# Altium schematic sheet Sheet_1_2021-03-30.schdoc
size 203 x 97 mm
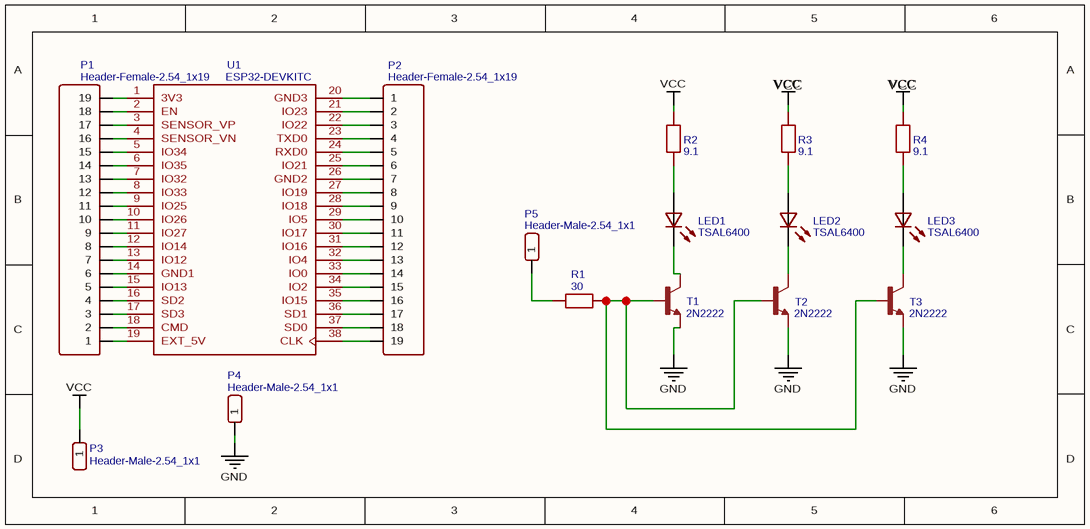
[diagram p0: Sheet_1_2021-03-30.schdoc]

## Parts
LED1  TSAL6400  [LED-5.8MM-2]
LED2  TSAL6400  [LED-5.8MM-2]
LED3  TSAL6400  [LED-5.8MM-2]
P1  Header-Female-2.54_1x19  [HDR-19X1/2.54]
P2  Header-Female-2.54_1x19  [HDR-19X1/2.54]
P3  Header-Male-2.54_1x1  [HDR-1X1/2.54]
P4  Header-Male-2.54_1x1  [HDR-1X1/2.54]
P5  Header-Male-2.54_1x1  [HDR-1X1/2.54]
R1  30  [AXIAL-0.3]
R2  9.1  [AXIAL-0.3]
R3  9.1  [AXIAL-0.3]
R4  9.1  [AXIAL-0.3]
T1  2N2222  [TO92-EBC-OVAL]
T2  2N2222  [TO92-EBC-OVAL]
T3  2N2222  [TO92-EBC-OVAL]
U1  ESP32-DEVKITC  [MODULE_ESP32-DEVKITC-32D]

## Nets
GND: P4.1 T1.E T2.E T3.E
VCC: P3.1 R2.2 R3.2 R4.2
NetLED1_1: LED1.1(A) R2.1
NetLED1_2: LED1.2(C) T1.C
NetLED2_1: LED2.1(A) R3.1
NetLED2_2: LED2.2(C) T2.C
NetLED3_1: LED3.1(A) R4.1
NetLED3_2: LED3.2(C) T3.C
NetP1_1: P1.1 U1.19(EXT_5V)
NetP1_2: P1.2 U1.18(CMD)
NetP1_3: P1.3 U1.17(SD3)
NetP1_4: P1.4 U1.16(SD2)
NetP1_5: P1.5 U1.15(IO13)
NetP1_6: P1.6 U1.14(GND1)
NetP1_7: P1.7 U1.13(IO12)
NetP1_8: P1.8 U1.12(IO14)
NetP1_9: P1.9 U1.11(IO27)
NetP1_10: P1.10 U1.10(IO26)
NetP1_11: P1.11 U1.9(IO25)
NetP1_12: P1.12 U1.8(IO33)
NetP1_13: P1.13 U1.7(IO32)
NetP1_14: P1.14 U1.6(IO35)
NetP1_15: P1.15 U1.5(IO34)
NetP1_16: P1.16 U1.4(SENSOR_VN)
NetP1_17: P1.17 U1.3(SENSOR_VP)
NetP1_18: P1.18 U1.2(EN)
NetP1_19: P1.19 U1.1(3V3)
NetP2_1: P2.1 U1.20(GND3)
NetP2_2: P2.2 U1.21(IO23)
NetP2_3: P2.3 U1.22(IO22)
NetP2_4: P2.4 U1.23(TXD0)
NetP2_5: P2.5 U1.24(RXD0)
NetP2_6: P2.6 U1.25(IO21)
NetP2_7: P2.7 U1.26(GND2)
NetP2_8: P2.8 U1.27(IO19)
NetP2_9: P2.9 U1.28(IO18)
NetP2_10: P2.10 U1.29(IO5)
NetP2_11: P2.11 U1.30(IO17)
NetP2_12: P2.12 U1.31(IO16)
NetP2_13: P2.13 U1.32(IO4)
NetP2_14: P2.14 U1.33(IO0)
NetP2_15: P2.15 U1.34(IO2)
NetP2_16: P2.16 U1.35(IO15)
NetP2_17: P2.17 U1.36(SD1)
NetP2_18: P2.18 U1.37(SD0)
NetP2_19: P2.19 U1.38(CLK)
NetP5_1: P5.1 R1.1
NetR1_2: R1.2 T1.B T2.B T3.B

## Notes on the sheet
- (near R3) VCC
- (near R4) VCC

## Library data of the parts
LED1-LED3 = TSAL6400: BOM_Manufacturer: VISHAY; Contributor: Russell Bryson; BOM_Supplier: LCSC; BOM_Manufacturer Part: TSAL6400; BOM_Supplier Part: C94857; spicePre: L; spiceSymbolName: TSAL6400
P1 P2 = Header-Female-2.54_1x19: BOM_Manufacturer: BOOMELE; BOM_Manufacturer Part: 2.54mm 1*20P Female header; Contributor: erikhjertholm; BOM_Supplier: LCSC; BOM_Supplier Part: C50984; spicePre: P; spiceSymbolName: Header-Female-2.54_1x19
P3-P5 = Header-Male-2.54_1x1: BOM_Manufacturer: ReliaPro; BOM_Supplier: LCSC; BOM_Manufacturer Part: Header-Male-2.54_1x1; BOM_Supplier Part: C81276; spicePre: P; spiceSymbolName: Header-Male-2.54_1x1
R1 = 30: nameAlias: Value(Ω); spicePre: R; spiceSymbolName: Res_AXIAL-0.3(1/8W)_EU
R2-R4 = 9.1: nameAlias: Value(Ω); spicePre: R; spiceSymbolName: Res_AXIAL-0.3(1/8W)_EU
T1-T3 = 2N2222: Contributor: Adafruit; spicePre: T; spiceSymbolName: 2N2222
U1 = ESP32-DEVKITC: Contributor: PatriceBarret; spicePre: U; spiceSymbolName: ESP32-DEVKITC-32D_ESP32-DEVKITC-32D